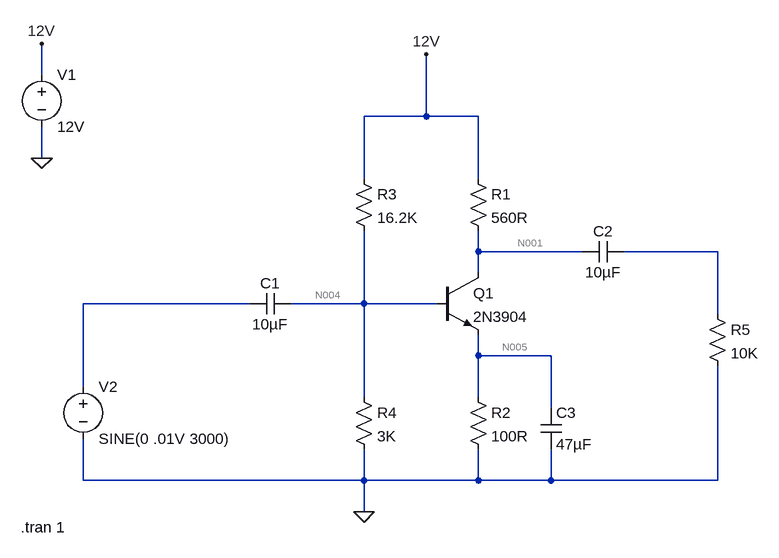
[diagram p0: schematic MicroAmp.asc]
MicroAmp.asc, the LTspice schematic file:
Version 4
SHEET 1 880 680
WIRE -464 -176 -464 -224
WIRE 128 -112 128 -208
WIRE 128 -112 32 -112
WIRE 208 -112 128 -112
WIRE -464 -48 -464 -96
WIRE 32 -16 32 -112
WIRE 208 -16 208 -112
WIRE 208 96 208 64
WIRE 368 96 208 96
WIRE 576 96 432 96
WIRE 208 128 208 96
WIRE -144 176 -400 176
WIRE 32 176 32 64
WIRE 32 176 -80 176
WIRE 144 176 32 176
WIRE 576 192 576 96
WIRE 208 256 208 224
WIRE 320 256 208 256
WIRE -400 304 -400 176
WIRE 32 320 32 176
WIRE 208 320 208 256
WIRE 320 336 320 256
WIRE -400 448 -400 384
WIRE 32 448 32 400
WIRE 32 448 -400 448
WIRE 208 448 208 400
WIRE 208 448 32 448
WIRE 320 448 320 400
WIRE 320 448 208 448
WIRE 576 448 576 272
WIRE 576 448 320 448
WIRE 32 496 32 448
FLAG -464 -224 12V
FLAG -464 -48 0
FLAG 128 -208 12V
FLAG 32 496 0
SYMBOL npn 144 128 R0
SYMATTR InstName Q1
SYMATTR Value 2N3904
SYMBOL res 192 -32 R0
SYMATTR InstName R1
SYMATTR Value 560R
SYMBOL res 192 304 R0
SYMATTR InstName R2
SYMATTR Value 100R
SYMBOL res 16 -32 R0
SYMATTR InstName R3
SYMATTR Value 16.2K
SYMBOL res 16 304 R0
SYMATTR InstName R4
SYMATTR Value 3K
SYMBOL cap -80 160 R90
WINDOW 0 0 32 VBottom 2
WINDOW 3 32 32 VTop 2
SYMATTR InstName C1
SYMATTR Value 10µF
SYMBOL cap 432 80 R90
WINDOW 0 0 32 VBottom 2
WINDOW 3 32 32 VTop 2
SYMATTR InstName C2
SYMATTR Value 10µF
SYMBOL voltage -464 -192 R0
SYMATTR InstName V1
SYMATTR Value 12V
SYMBOL voltage -400 288 R0
WINDOW 123 0 0 Left 0
WINDOW 39 0 0 Left 0
SYMATTR InstName V2
SYMATTR Value SINE(0 .01V 3000)
SYMBOL res 560 176 R0
SYMATTR InstName R5
SYMATTR Value 10K
SYMBOL cap 304 336 R0
SYMATTR InstName C3
SYMATTR Value 47µF
TEXT -496 520 Left 2 !.tran 1

The netlist it stands for:
* MicroAmp.asc
Q1 N001 N004 N005 0 2N3904
R1 12V N001 560R
R2 N005 0 100R
R3 12V N004 16.2K
R4 N004 0 3K
C1 N004 N003 10µF
C2 N002 N001 10µF
V1 12V 0 12V
V2 N003 0 SINE(0 .01V 3000)
R5 N002 0 10K
C3 N005 0 47µF
.model NPN NPN
.model PNP PNP
.lib standard.bjt
.tran 1
.backanno
.end

* Results of the author's LTspice run, read from the files saved beside the schematic
* Operating Point, zero values left out:
*   V(n001) = 6.034 V
*   V(n004) = 1.787 V
*   V(n005) = 1.069 V
*   V(12v) = 12 V
*   Ic(Q1) = 10.65 mA
*   Ib(Q1) = 34.94 µA
*   Ie(Q1) = -10.69 mA
*   I(R4) = 595.5 µA
*   I(R3) = 630.5 µA
*   I(R2) = 10.69 mA
*   I(R1) = 10.65 mA
*   I(V1) = -11.28 mA